# Altium schematic sheet [05] RTC_RS232_USB.SchDoc
size A4
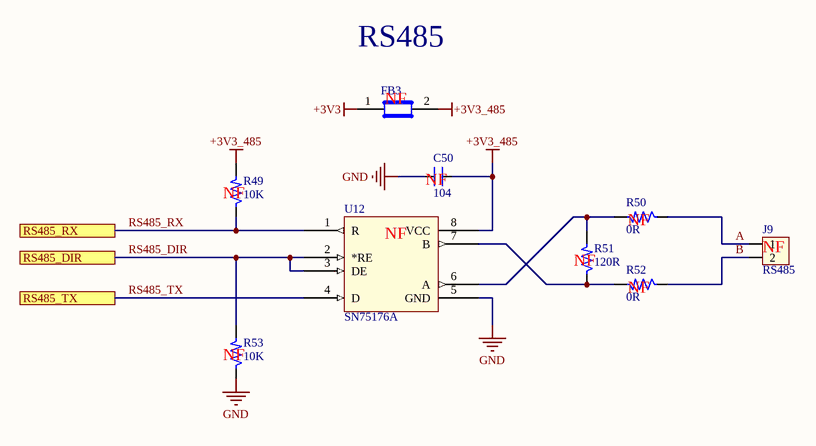
[diagram p0: [05] RTC_RS232_USB.SchDoc]

## Parts
C50  104  [CAP_0805]
FB3  BLM21PG600SN1D  [R0805]  (value not drawn)
J9  RS485  [Hed2V_3.96]
R49  10K  [RES-SMD-0805]
R50  0R  [RES-SMD-0805]
R51  120R  [RES-SMD-0805]
R52  0R  [RES-SMD-0805]
R53  10K  [RES-SMD-0805]
U12  SN75176A  [SN75176A]

## Ports
RS485_DIR, RS485_RX, RS485_TX

## Nets
+3V3: FB3.1
+3V3_485: C50.2 FB3.2 R49.2 U12.8(VCC)
GND: C50.1 R53.1 U12.5(GND)
A: J9.1 R50.1
B: J9.2 R52.1
RS485_DIR: R53.2 U12.2(*RE) U12.3(DE) ; port RS485_DIR
RS485_RX: R49.1 U12.1(R) ; port RS485_RX
RS485_TX: U12.4(D) ; port RS485_TX
NetR50_2: R50.2 R51.2 U12.6(A)
NetR51_1: R51.1 R52.2 U12.7(B)

## Notes on the sheet
- RS485
- (near FB3) NF
- (near R49) NF
- (near U12) NF
- (near C50) NF
- (near R50) NF
- (near R51) NF
- (near R52) NF
- (near J9) NF
- (near R53) NF

## Library data of the parts
C50 = CM: Cap SMD; Value: 103
FB3 = Ferrite Bead
J9 = Hed2: Header 2 (Green); Value: Header 2
R49-R53 = RM: Resistor SMD; Value: 1K